# EAGLE schematic ESP8266_ATM90E26_Emon (EAGLE 7.4.0)
CNAME: ESP8266 Single Phase Energy Monitor; CREVISION: 0.1; DESIGNER: Tisham Dhar
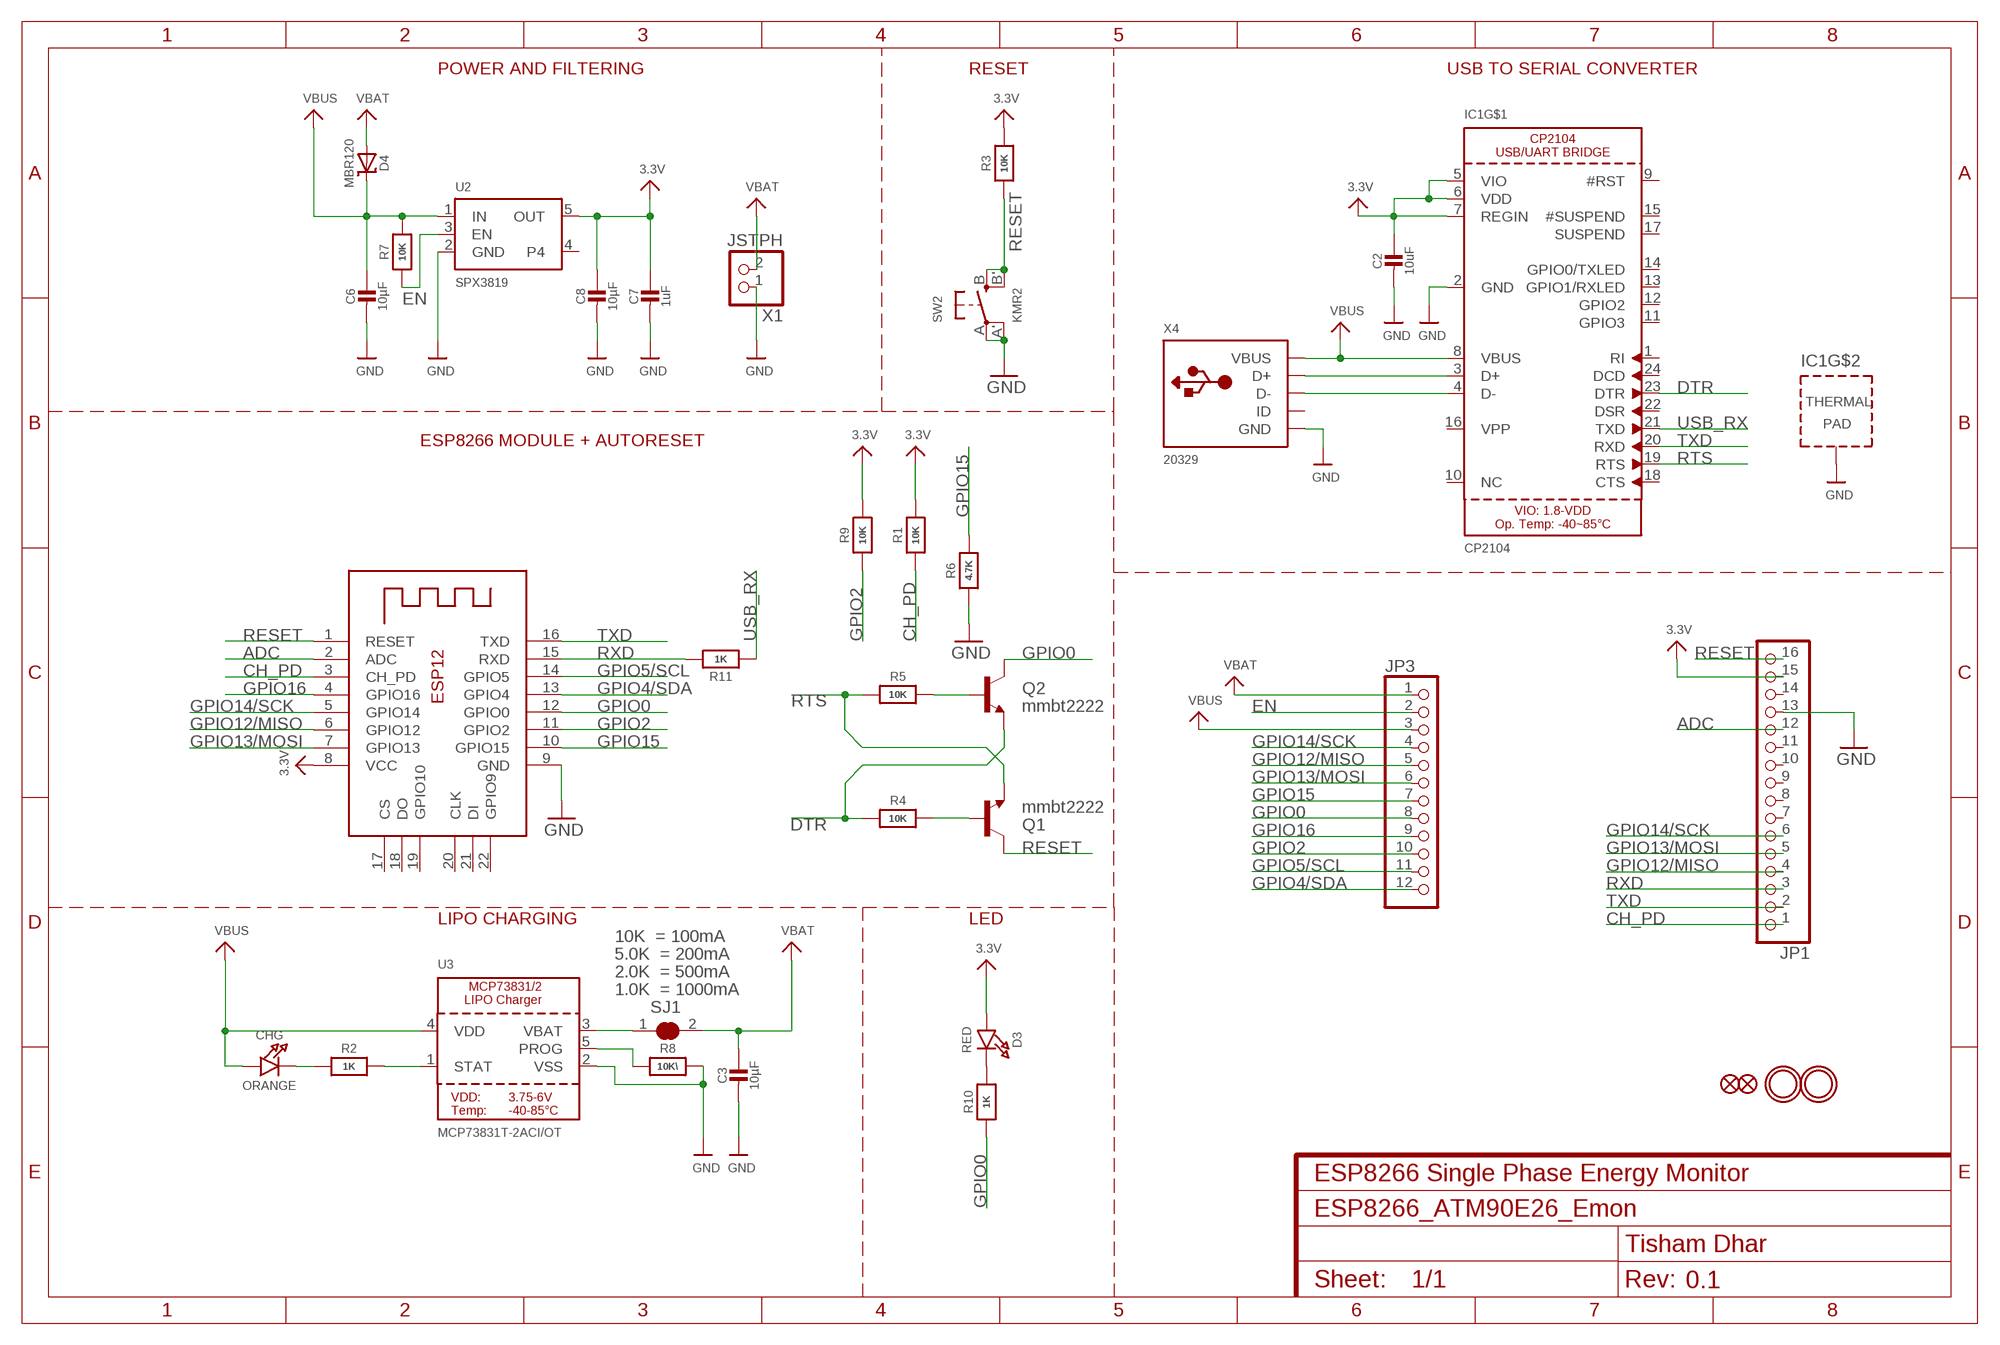
[diagram p0: schematic, sheet 1, part 1 of 2]
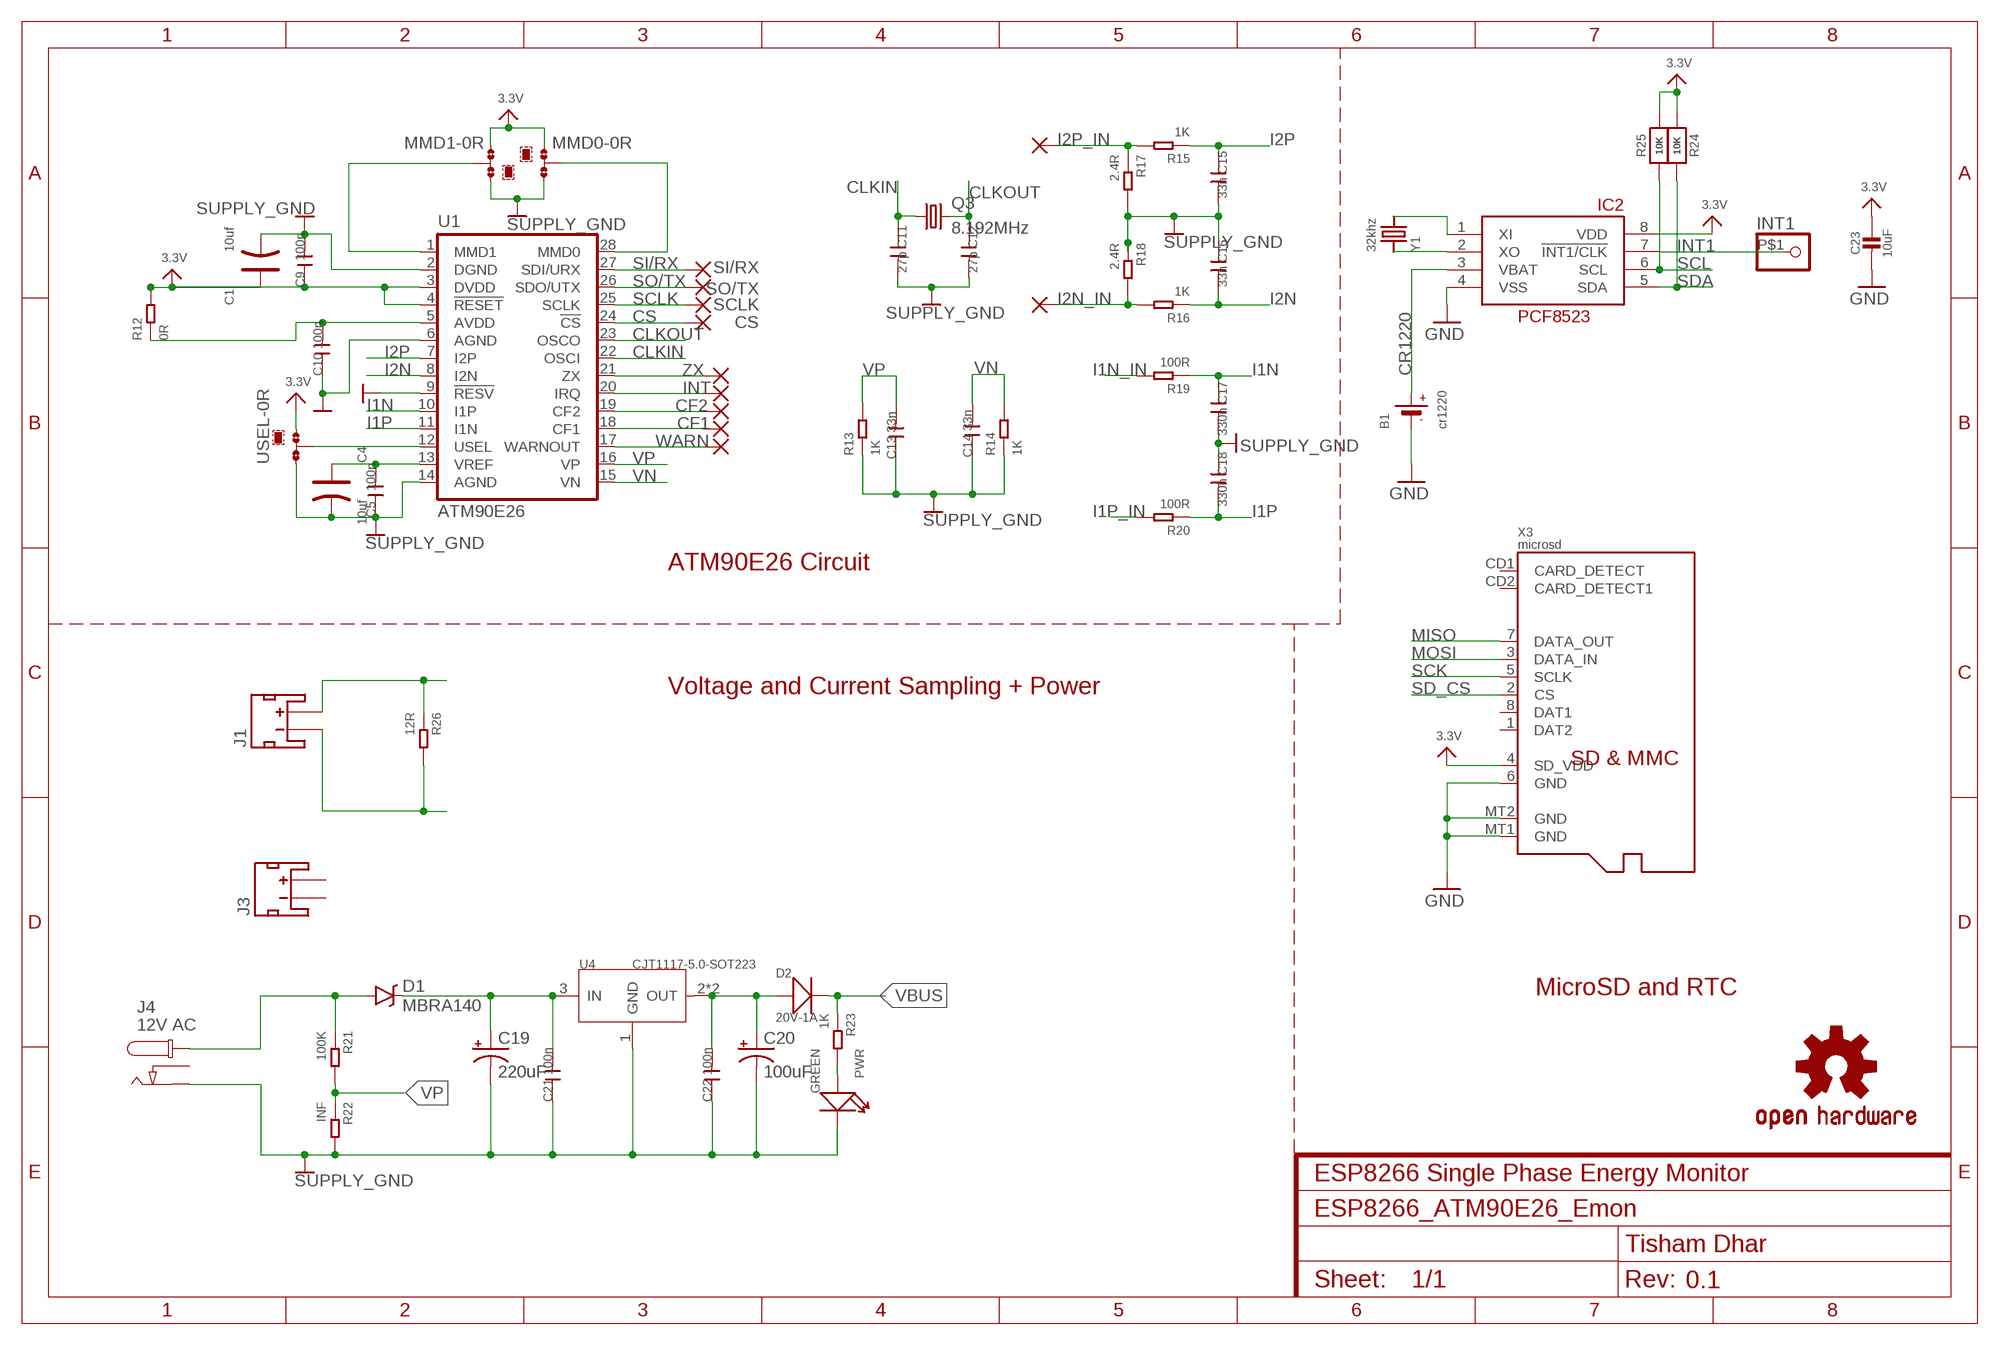
[diagram p1: schematic, sheet 1, part 2 of 2]

## Parts
B1  cr1220  BATTERYCR1220_SMT  [CR1220]
C1  10uf  TANTALUM-SMD-22UF-10V(AVX-A)  [AVX-A]
C2  10uF  CAP_CERAMIC0603_NO  [0603-NO]
C3  10µF  CAP_CERAMIC0603_NO  [0603-NO]
C4  10uf  TANTALUM-SMD-22UF-10V(AVX-A)  [AVX-A]
C5  100n  C-0603  [C0603]
C6  10µF  CAP_CERAMIC0603_NO  [0603-NO]
C7  1uF  CAP_CERAMIC0603_NO  [0603-NO]
C8  10µF  CAP_CERAMIC0603_NO  [0603-NO]
C9  100n  C-0603  [C0603]
C10  100n  C-0603  [C0603]
C11  27p  C-0603  [C0603]
C12  27p  C-0603  [C0603]
C13  33n  C-0603  [C0603]
C14  33n  C-0603  [C0603]
C15  33n  C-0603  [C0603]
C16  33n  C-0603  [C0603]
C17  330n  C-0603  [C0603]
C18  330n  C-0603  [C0603]
C19  220uF  CPOL-US140CLH-1010  [140CLH-1010]
C20  100uF  CPOL-US153CLV-0605  [153CLV-0605]
C21  100n  C-0603  [C0603]
C22  100n  C-0603  [C0603]
C23  10uF  CAP_CERAMIC0603_NO  [0603-NO]
CF1  WIREPADSMD1,27-254  [SMD1,27-2,54]
CF2  WIREPADSMD1,27-254  [SMD1,27-2,54]
CHG  ORANGE  LED0603_NOOUTLINE  [CHIPLED_0603_NOOUTLINE]
CS  WIREPADSMD1,27-254  [SMD1,27-2,54]
D1  MBRA140  [SMA-DIODE]
D2  20V-1A  SMD-DIODE-SCHOTTKY-20V-1A(SOD-123)  [SOD-123]
D3  RED  LED0805_NOOUTLINE  [CHIPLED_0805_NOOUTLINE]
D4  MBR120  DIODE-SCHOTTKYSOD-123  [SOD-123]
I2N_IN  WIREPADSMD1,27-254  [SMD1,27-2,54]
I2P_IN  WIREPADSMD1,27-254  [SMD1,27-2,54]
IC1  CP2104  [QFN24_4MM_SMSC]
IC2  RTC_PCF8523T  [SOIC8_150MIL]
INT  WIREPADSMD1,27-254  [SMD1,27-2,54]
INT1  HEADER-1X1-SMD-MASKHELD_1X2MM  [1X01_SMD_MASKHELD_1X2MM]
J1  JST_2MM_MALE  [JST-2-SMD]
J3  JST_2MM_MALE  [JST-2-SMD]
J4  12V AC  CON_DC_M-DC_SMD  [DC_BARREL_JACK_SMD_2MM]
JP1  HEADER-1X16ROUND  [1X16_ROUND]
JP3  HEADER-1X12  [1X12_ROUND]
LOGO1  OSHW-LOGOS  [OSHW-LOGO-S]
MMD0  0R-JUMPA  [A0R-JMP]
MMD1  0R-JUMPA  [A0R-JMP]
PWR  GREEN  LED'0603'  [LED-0603]
Q1  mmbt2222  TRANSISTOR_NPNSOT23-3  [SOT23-3]
Q2  mmbt2222  TRANSISTOR_NPNSOT23-3  [SOT23-3]
Q3  8.192MHz  CRYSTALHC49UP  [HC49UP]
R1  10K  RESISTOR_0603_NOOUT  [0603-NO]
R2  1K  RESISTOR_0603_NOOUT  [0603-NO]
R3  10K  RESISTOR_0603_NOOUT  [0603-NO]
R4  10K  RESISTOR_0603_NOOUT  [0603-NO]
R5  10K  RESISTOR_0603MP  [_0603MP]
R6  4.7K  RESISTOR_0603_NOOUT  [0603-NO]
R7  10K  RESISTOR_0603_NOOUT  [0603-NO]
R8  10K\  RESISTOR_0603_NOOUT  [0603-NO]
R9  10K  RESISTOR_0603_NOOUT  [0603-NO]
R10  1K  RESISTOR_0603_NOOUT  [0603-NO]
R11  1K  RESISTOR_0603MP  [_0603MP]
R12  0R  SMD-RES-0R(0603)  [R0603]
R13  1K  SMD-RES-1K(0603)  [R0603]
R14  1K  SMD-RES-1K(0603)  [R0603]
R15  1K  SMD-RES-1K(0603)  [R0603]
R16  1K  SMD-RES-1K(0603)  [R0603]
R17  2.4R  SMD-RES-1K(0603)  [R0603]
R18  2.4R  SMD-RES-1K(0603)  [R0603]
R19  100R  SMD-RES-1K(0603)  [R0603]
R20  100R  SMD-RES-1K(0603)  [R0603]
R21  100K  SMD-RES-0R(0603)  [R0603]
R22  INF  SMD-RES-0R(0603)  [R0603]
R23  1K  SMD-RES-0R(0603)  [R0603]
R24  10K  RESISTOR_0603_NOOUT  [0603-NO]
R25  10K  RESISTOR_0603_NOOUT  [0603-NO]
R26  12R  SMD-RES-0R(0603)  [R0603]
SCLK  WIREPADSMD1,27-254  [SMD1,27-2,54]
SI/RX  WIREPADSMD1,27-254  [SMD1,27-2,54]
SJ1  SOLDERJUMPER_CLOSED  [SOLDERJUMPER_CLOSEDWIRE]
SO/TX  WIREPADSMD1,27-254  [SMD1,27-2,54]
SW2  KMR2  SWITCH_TACT_SMT4.6X2.8  [BTN_KMR2_4.6X2.8]
U1  ATM90E26  [SSOP-28]
U2  SPX3819  VREG_SOT23-5  [SOT23-5]
U3  MCP73831T-2ACI/OT  MCP73831/2  [SOT23-5]
U4  CJT1117-5.0-SOT223  PMIC-CJT1117-5.0(SOT223)  [SOT-223]
U$31  MOUNTINGHOLE2.5  [MOUNTINGHOLE_2.5_PLATED]
U$32  MOUNTINGHOLE2.5  [MOUNTINGHOLE_2.5_PLATED]
U$34  FIDUCIAL""  [FIDUCIAL_1MM]
U$35  FIDUCIAL""  [FIDUCIAL_1MM]
USEL  0R-JUMPA  [A0R-JMP]
WARN  WIREPADSMD1,27-254  [SMD1,27-2,54]
X1  JSTPH  CON_JST_PH_2PIN  [JSTPH2]
X2  ESP-12  ESP-12E  [ESP-12E]
X3  microsd  MICROSD  [MICROSD]
X4  20329  USB_MICRO_20329_V2  [4UCONN_20329_V2]
Y1  32khz  CRYSTAL8.0X3.8  [CRYSTAL_8X3.8]
ZX  WIREPADSMD1,27-254  [SMD1,27-2,54]

## Nets
3.3V: C1.+ C2.1 C7.1 C8.1 C9.1 C23.1 D3.A IC1.5(VIO) IC1.6(VDD) IC1.7(REGIN) IC2.8(VDD) JP1.15 MMD0.1 MMD1.2 MMD1.3 R1.2 R3.2 R9.2 R12.2 R24.2 R25.2 U1.1(MMD1) U1.3(DVDD) U1.4(!RESET) U2.5(OUT) USEL.1 X2.8(VCC) X3.4(SD_VDD)
ADC: JP1.12 X2.2(ADC)
CH_PD: JP1.1 R1.1 X2.3(CH_PD)
CLKIN: C11.1 Q3.1 U1.22(OSCI)
CLKOUT: C12.1 Q3.2 U1.23(OSCO)
CR1220: B1.+$1(+) IC2.3(VBAT)
CS: CS.1(P) U1.24(!CS)
DTR: IC1.23(DTR) Q2.2(E) R4.1
EN: JP3.2 R7.1 U2.3(EN)
GND [pwr]: B1.- C1.- C2.2 C3.2 C4.- C5.1 C6.2 C7.2 C8.2 C9.2 C10.1 C11.2 C12.2 C13.1 C14.1 C15.2 C16.1 C17.2 C18.1 C19.- C20.- C21.1 C22.1 C23.2 IC1.2(GND) IC1.THERM(TP) IC2.4(VSS) J4.P2 JP1.13 MMD0.3 MMD1.1 PWR.- R6.1 R8.2 R13.1 R14.1 R17.2 R18.1 R22.2 SW2.A'(P1) SW2.A(P) U1.2(DGND) U1.6(AGND) U1.9(!RESV) U1.14(AGND) U2.2(GND) U3.2(VSS) U4.1(GND) USEL.3 X1.1 X2.9(GND) X3.6(GND) X3.MT1(GND) X3.MT2(GND) X4.BASE@1(GND) X4.BASE@2(GND) X4.GND X4.SPRT@1(GND) X4.SPRT@2(GND) X4.SPRT@3(GND) X4.SPRT@4(GND) ; supply symbol labelled SUPPLY_GND
GPIO0: JP3.8 Q2.3(C) R10.1 X2.12(GPIO0)
GPIO2: JP3.10 R9.1 X2.11(GPIO2)
GPIO4/SDA: JP3.12 X2.13(GPIO4)
GPIO5/SCL: JP3.11 X2.14(GPIO5)
GPIO12/MISO: JP1.4 JP3.5 X2.6(GPIO12)
GPIO13/MOSI: JP1.5 JP3.6 X2.7(GPIO13)
GPIO14/SCK: JP1.6 JP3.4 X2.5(GPIO14)
GPIO15: JP3.7 R6.2 X2.10(GPIO15)
GPIO16: JP3.9 X2.4(GPIO16)
I1N: C17.1 R19.1 U1.10(I1P)
I1N_IN: R19.2
I1N_IN1: J1.1(-) R26.2
I1P: C18.2 R20.1 U1.11(I1N)
I1P_IN: R20.2
I1P_IN1: J1.2(+) R26.1
I2N: C16.2 R16.1 U1.8(I2N)
I2N_IN: I2N_IN.1(P) R16.2 R18.2
I2P: C15.1 R15.1 U1.7(I2P)
I2P_IN: I2P_IN.1(P) R15.2 R17.1
INT1: IC2.7(!INT1/CLK) INT1.P$1
MISO: X3.7(DATA_OUT)
MOSI: X3.3(DATA_IN)
N$1: CHG.C R2.1
N$2: IC1.3(D+) X4.D+
N$3: R2.2 U3.1(STAT)
N$4: R8.1 U3.5(PROG)
N$5: D3.C R10.2
N$6: IC1.4(D-) X4.D-
N$7: SJ1.1 U3.3(VBAT)
N$8: CF2.1(P) U1.19(CF2)
N$10: MMD0.2 U1.28(MMD0)
N$11: CF1.1(P) U1.18(CF1)
N$12: Q1.1(B) R4.2
N$13: Q2.1(B) R5.2
N$14 [pwr]: C10.2 R12.1 U1.5(AVDD)
N$15: U1.12(USEL) USEL.2
N$16 [pwr]: D1.A J4.P1@2(P1) R21.1
N$17: C19.+ C21.2 D1.C U4.3(IN)
N$18: PWR.+ R23.2
N$19: IC2.1(XI) Y1.P$4
N$20: U1.21(ZX) ZX.1(P)
N$21: INT.1(P) U1.20(IRQ)
N$22: U1.17(WARNOUT) WARN.1(P)
N$23: IC2.2(XO) Y1.P$1
RESET: JP1.16 Q1.3(C) R3.1 SW2.B'(S1) SW2.B(S) X2.1(RESET)
RTS: IC1.19(RTS) Q1.2(E) R5.1
RXD: JP1.3 R11.2 X2.15(RXD)
SCK: X3.5(SCLK)
SCL: IC2.6(SCL) R25.1
SCLK: SCLK.1(P) U1.25(SCLK)
SD_CS: X3.2(CS)
SDA: IC2.5(SDA) R24.1
SI/RX: SI/RX.1(P) U1.27(SDI/URX)
SO/TX: SO/TX.1(P) U1.26(SDO/UTX)
TXD: IC1.20(RXD) JP1.2 X2.16(TXD)
USB_RX: IC1.21(TXD) R11.1
V_OUT [pwr]: C20.+ C22.2 D2.+ U4.2(OUT) U4.TER(OUT)
VBAT: C3.1 D4.A JP3.1 SJ1.2 X1.2
VBUS: C6.1 CHG.A D2.- D4.C IC1.8(VBUS) JP3.3 R7.2 R23.1 U2.1(IN) U3.4(VDD) X4.VBUS
VN: C14.2 R14.2 U1.15(VN)
VP: C13.2 R13.2 R21.2 R22.1 U1.16(VP)
VREF: C4.+ C5.2 U1.13(VREF)
Unconnected: IC1.1(RI) IC1.9(#RST) IC1.10(NC) IC1.11(GPIO3) IC1.12(GPIO2) IC1.13(GPIO1/RXLED) IC1.14(GPIO0/TXLED) IC1.15(#SUSPEND) IC1.16(VPP) IC1.17(SUSPEND) IC1.18(CTS) IC1.22(DSR) IC1.24(DCD) J1.NC1(PAD1) J1.NC2(PAD2) J3.1(-) J3.2(+) J3.NC1(PAD1) J3.NC2(PAD2) J4.P3 JP1.7 JP1.8 JP1.9 JP1.10 JP1.11 JP1.14 U2.4 X2.17(CS) X2.18(DO) X2.19(GPIO10) X2.20(CLK) X2.21(DI) X2.22(GPIO9) X3.1(DAT2) X3.8(DAT1) X3.CD1(CARD_DETECT) X3.CD2(CARD_DETECT1) X4.ID

## Notes on the sheet
- POWER AND FILTERING | RESET | USB TO SERIAL CONVERTER
- ESP8266 MODULE + AUTORESET
- ATM90E26 Circuit
- Voltage and Current Sampling + Power
- LIPO CHARGING | LED
- 10K  = 100mA
- 5.0K  = 200mA
- 2.0K  = 500mA
- 1.0K  = 1000mA | MicroSD and RTC

## Library data of the parts
B1 = microbuilder:BATTERY: CR1220 SMT - Digikey: 3001K-ND CD2032 BAT-HLD-001 - Digikey: BAT-HLD-001-ND
C1 C4 = Seeed-Capacitor-2016:TANTALUM-SMD-22UF-10V(AVX-A): 302020008; MPN: TAJA226*010#NJ; VALUE: 22uf
C2 C3 C6-C8 C23 = microbuilder:CAP_CERAMIC: Ceramic Capacitors For new designs, use the packages preceded by an '_' character since they are more reliable: The following footprints should be used on most boards: _0402 - Standard footprint for regular board layouts _0603 - Standard footprint for regular board layouts _0805 - Standard footprint for regular board layouts _1206 - Standard footprint for regular board layouts For extremely tight-pitch boards where space is at a premium, the following 'micro-pitch' footprints can be used (smaller pads, no silkscreen outline, etc.): _0402MP - Micro-pitch footprint for very dense/compact boards _0603MP - Micro-pitch footprint for very dense/compact boards _0805MP - Micro-pitch footprint for very dense/compact boards _1206MP - Micro-pitch footprint for very dense/compact boards
C5 C9-C18 C21 C22 = Discrete:C*: Ceramic Capacitors
C19 C20 = adafruit:CPOL-US: POLARIZED CAPACITOR, American symbol
CF1 CF2 CS I2N_IN I2P_IN INT SCLK SI/RX SO/TX WARN ZX = wirepad:WIREPAD: Wire PAD connect wire on PCB
CHG D3 = microbuilder:LED: LED 0603 - 0603 Surface Mount Package 2mA: Green LED - Low Power (3.9mcd, 2ma, 1.7Vf) - Digikey: 475-2709-2-ND Orange LED - Low Power (9.8mcd, 2ma, 1.8Vf) - Digikey: 475-1194-2-ND Red LED - Low Power (5mcd, 2ma, 1.8Vf) - Digikey: 475-1195-2-ND Yellow LED - Low Power (7mcd, 2ma, 1.8Vf) - Digikey: 475-1196-2-ND 5mA: Blue LED - Low Power (17mcd, 5ma, 2.9Vf) - Digikey: LNJ937W8CRACT-ND 0805 - 0805 Surface Mount Package 2mA: Red LED (8.8mcd, 2mA, 1.8Vf, Clear) - Low Power [Digikey: 475-2510-1-ND] Green LED (5mcd, 2mA, 1.8Vf, Clear) - Low Power [Digikey: 475-2730-1-ND] Yellow LED (11.3mcd, 2mA, 1.8Vf, Clear) - Low Power [Digikey: 475-2555-1-ND] 20mA: Red LED (104mcd, 20mA, Diffused) - LS R976 [Digikey: 475-1278-6-ND] Red LED (12mcd, 20mA, 2.0Vf, Clear) - APT2012EC [Digikey: 754-1128-1-ND] Green LED (15mcd, 20mA, 2.2Vf, Clear) - APT2012GC [Digikey: 754-1131-1-ND] Orange LED (160mcd, 20mA, 2.1Vf, Clear) - APT2012SECK [Digikey: 754-1130-1-ND] 1206 - 1206 Surface Mount Package Green LED (26mcd, 20mA, Diffused) - LG N971 [Digikey: 475-1407-6-ND] Red LED (15mcd, 20mA, Diffused) - LH N974 [Digikey: 475-1416-6-ND] Cree - Cree High-Power Surface Mount LEDs XPEBWT-L1-0000-00D50 - White 111lm 350mA 2.9Vf 6200K 110° XTEAWT-00-0000-00000LEE3 - White 114lm 350mA 2.85Vf 5000K 115° Everlight - Everlight 45-21 Series Surface Mount LEDs 45-21/QK2C-B2832AC2CB2/2T - Warm White 2000mcd 20mA 3.25Vf 3050K 120° 45-21/LK2C-B38452C4CB2/2T - Nuetral White 2000mcd 20mA 3.25Vf 4150K 120° 45-21/LK2C-B50634C6CB2/2T - Cold White 2200mcd 20mA 3.25Vf 5650K 120° PLCC2 Reverse Mount LS T77K-J1L2-1-0-2-R18-Z - Red 11.25mcd 2mA 1.8Vf 630nm 120° LO T77K-L1M2-24-Z - Orange 19.6mcd 2mA 1.8Vf 606nm 120° LY T77K-K2M1-26-Z - Yellow 15.7mcd 2mA 1.8Vf 587nm 120°
D1 = SparkFun-DiscreteSemi:MBRA140: 40V, 1A Schottky rectifier SMA/DO-214AC package DIO-08053; PROD_ID: DIO-08053
D2 = Seeed-OPL-Diode:SMD-DIODE-SCHOTTKY-20V-1A(SOD-123): 304020034; MPN: B5819W
D4 = microbuilder:DIODE-SCHOTTKY
IC1 = microbuilder:CP2104: CP2104 - USB to UART Bridge VDD Output: 3.45V
IC2 = microbuilder:RTC_PCF8523
INT1 = microbuilder:HEADER-1X1: PIN HEADER
J1 J3 = SparkFun-Connectors:JST_2MM_MALE: Mates to single-cell LiPo batteries. CONN-08352; PROD_ID: CONN-08352
J4 = dp_devices:CON_DC_M: DC power connector
JP1 = microbuilder:HEADER-1X16: PIN HEADER
JP3 = microbuilder:HEADER-1X12
LOGO1 = SparkFun-Aesthetics:OSHW-LOGO: Open Source Hardware Logo This logo indicates the piece of hardware it is found on incorporates a OSHW license and/or adheres to the definition of open source hardware found here: http://freedomdefined.org/OSHW
MMD0 MMD1 USEL = jump-0r-smd:0R-JUMP: SMD 0R 0805 Jumper
PWR = Discrete-new:LED
Q1 Q2 = SparkFun:TRANSISTOR_NPN: Transistor NPN BJT configuration in SOT23 package. MMBT2222 is the common NPN we use. Double check BCE configuration again layout.
Q3 = crystal:CRYSTAL: CRYSTAL; OC_FARNELL: unknown; OC_NEWARK: unknown
R1-R11 R24 R25 = microbuilder:RESISTOR: Resistors For new designs, use the packages preceded by an '_' character since they are more reliable: The following footprints should be used on most boards: _0402 - Standard footprint for regular board layouts _0603 - Standard footprint for regular board layouts _0805 - Standard footprint for regular board layouts _1206 - Standard footprint for regular board layouts For extremely tight-pitch boards where space is at a premium, the following 'micro-pitch' footprints can be used (smaller pads, no silkscreen outline, etc.): _0402MP - Micro-pitch footprint for very dense/compact boards _0603MP - Micro-pitch footprint for very dense/compact boards _0805MP - Micro-pitch footprint for very dense/compact boards _1206MP - Micro-pitch footprint for very dense/compact boards
R12 = Seeed-Resistor-2016:SMD-RES-0R(0603): 301010292; MPN: RC0603JR-070RL
R13-R16 = Seeed-Resistor-2016:SMD-RES-1K(0603): 301010298; MPN: RC0603FR-071KL
R17-R20 = Seeed-Resistor-2016:SMD-RES-1K(0603): 301010298; MPN: RC0603FR-071KL; VALUE: 1K
R21-R23 R26 = Seeed-Resistor-2016:SMD-RES-0R(0603): 301010292; MPN: RC0603JR-070RL; VALUE: 0R
SJ1 = microbuilder:SOLDERJUMPER_CLOSED: Solder Jumper - Closed These solder jumpers are closed by default CLOSEDWIRE - 10 mil trace between pads that can be cut and resoldered later CLOSEDPERM - 63 mil trace between pads for a permanent connection (used to 'bridge' two signals, a shameless hack for Eagle). Can double as a test point as well (no cream layer)
SW2 = microbuilder:SWITCH_TACT_SMT: SMT Tact Switches 6x6mm - Digikey: P12940SCT-ND KMR2 (4.6x2.8mm) - Digikey: 401-1426-1-ND EVQ-PQHB55 - Light Touch, 160GF (4.5x4.5mm) - Digikey: P8090SCT-ND KMT0 - KMT021 NGJ LHS (etc.) IP68/Waterproof - Digikey: CKN10289CT-ND
U1 = ATM90E26:ATM90E26: Single-Phase High-Per formance Wide-Span Energy Metering IC
U2 = microbuilder:VREG_SOT23-5: SOT23-5 Fixed Voltage Regulators Part Current Out V Out V In V Dropout θJA (°C/W) TJ (°C) Digikey Part No. ADP121 150mA 3.3V 3.4-5.5V 0.09V @ 150mA -- -- ADP121-AUJZ33R7CT-ND ADP121 150mA 3.0V 3.1-5.5V 0.09V @ 150mA -- -- ADP121-AUJZ30R7CT-ND ADP122 300mA 3.3V 3.4-5.5V 0.085V @ 300mA -- -- ADP122AUJZ-3.3-R7CT-ND ADP1712 300mA 3.3V 3.5-5.5V 0.17V @ 300mA -- -- ADP1712AUJZ-3.3-R7TR-ND AP7311 (Low Cost) 150mA 3.3V 3.5-6V 0.15V @ 150mA -- -- AP7311-33WG-7DICT-ND LD39015M18R 150mA 1.8V 1.9V-5.5V 0.08V @ 100mA -- -- 497-6977-1-ND LP2985A-33DBVR 150mA 3.3V 3.3-16V 0.28V @ 150mA 206 150 296-18479-1-ND MCP1824T-3302E/OT 300mA 3.3V 3.5V-6V 0.2V @ 300mA -- -- MCP1824T-3302E/OTCT-ND MIC5205-2.5YM5 TR 150mA 2.5V 2.7-16V 0.165V @ 150mA -- -- 576-1257-2-ND MIC5205-3.0YM5 TR 150mA 3.0V 3.2V-16V 0.165V @ 150mA -- -- 576-1258-2-ND MIC5205-3.3YM5 TR 150mA 3.3V 3.5V-16V 0.165V @ 150mA -- -- 576-1259-2-ND TPS780330220 150mA 3.3V+2.2V 3.6-5.5V 250mV Max -- -- 296-23332-1-ND TDA3663/N1,135 100mA 3.3V 3.5-45V 0.18V @ 50mA -- -- 568-5343-1-ND Max operating temp can be calculated using θJA, TJ (max junction temperature), and power in watts. Set the "Maximum Ambient Temperature" until it reaches TJ ("Max Junction Temperature"), which is the absolute limit for safe use of the regulator: Heat Sink Temperature Calculator <http://www.daycounter.com/Calculators/Heat-Sink-Temperature-Calculator.phtml> For example, With 12V source into a 3.3V LP2985 and a 30mA load, we are dissipating (12V-3.3V) * 0.03A = 0.261W. With a θJA of 206 °C/W, a TJ of 150°C, and 261mW we can safely use the chip without a heat sink up to 75°C (=147.1°C Junction Temperature).
U3 = microbuilder:MCP73831/2: MCP73831/2 LIPO Charger VDD: 3.75 - 6V Temp -40 - 85°C Programmable Charge Rate: 15-500mA NOTE: STAT is a tri-state logic output on the MCP73831 and an open-drain output on the MCP73832. SOT23-5 with 4.2V output and tri-state logic on STAT = MCP73831T-2ACI/OT
U4 = Seeed-IC-2016:PMIC-CJT1117-5.0(SOT223): 310030096; MPN: CJT1117-5.0
U$31 U$32 = microbuilder:MOUNTINGHOLE: Mounting Hole For #2 screws (0.086"/2.18mm width, 0.094"/2.4mm hole) use 2.5mm; BOM: EXCLUDE
U$34 U$35 = microbuilder:FIDUCIAL: Fiducial Alignment Points Various fiducial points for machine vision alignment.; BOM: EXCLUDE
X1 = microbuilder:CON_JST_PH_2PIN: JST 2-Pin Right-Angle Connector PH-Series - 4UConnector: 17311 SH-Series - 4UConnector: 07278
X2 = microbuilder:ESP-12E
X3 = microbuilder:MICROSD: MicroSD/Transflash Card Holder with SPI pinout 3M: 2908-05WB-MG 4UConnector: 19656 Footprint courtesy: Adafruit Industries
X4 = microbuilder:USB: USB Connectors USBMINIB - Surface Mount Female Mini-B USB Connector 4UConnector: 06564
Y1 = microbuilder:CRYSTAL: Crystals HC49UP - Surface Mount Crystal 4.0MHz 18pF +/-30ppm Surface Mount Crystal [Digikey: 535-9857-1-ND] 12.0 MHz Surface Mount Crystal [Digikey: 535-9869-6-ND] 25.0 MHz Surface Mount Crystal [Digikey: 535-9078-1-ND] 2.5 x 2.0mm - MEMs SMT Crystal 16.0 MHz 10pF 20ppm 2.5 x 2.0mm Crystal [Digikey -40-85°C: 535-10923-1-ND] 3.2 x 2.5mm - MEMs SMT Crystal 12.0 MHz 8pF 15ppm 3.2 x 2.5mm Crystal [Digikey: -10-70°C: 644-1047-1-ND -40-125°C: 644-1128-1-ND] 40~85°C cheaper: 644-1173-6-ND 16.0 MHz 8pF 15ppm 3.2 x 2.5mm Crystal [Digikey: -10-70°C: 644-1049-1-ND -40-125°C: 644-1129-2-ND]-40~85°C cheaper: 644-1175-6-ND 16.0 MHz 10pF 10ppm 3.2 x 2.5mm Crystal [Digikey: 644-1100-1-ND] 27.12 MHz 18pF 30ppm 3.2 x 2.5mm Crystal [Digikey: 887-1424-1-ND] 27.12MHz 10pF 10ppm 3.2 x 2.5mm Crystal [Digikey: 887-1329-1-ND] 4.9 x 1.8mm - MEMs SMT Crystal 32.768 KHz 12.5pF 20ppm 4.9 x 1.8mm Crystal [Digikey: SE2415CT-ND] 8.0 x 3.8mm - Surface Mount Crystal 32.768kHz 12.5pF 20ppm -40°C-85°C [Digikey: 535-9166-2-ND] Cylinder 32.768KHz Cylinder Crystal (2x6mm body) [Ex. Digikey: 300-8341-2-ND]

## Net classes
0 default: width 0.254 mm, drill 0.33 mm, clearance 0.152 mm
1 pwr: width 0.356 mm, drill 0.33 mm, clearance 0.152 mm